# Altium schematic sheet Voltage_generation.SchDoc
size A3; SheetNumber: 3; SheetTotal: 3
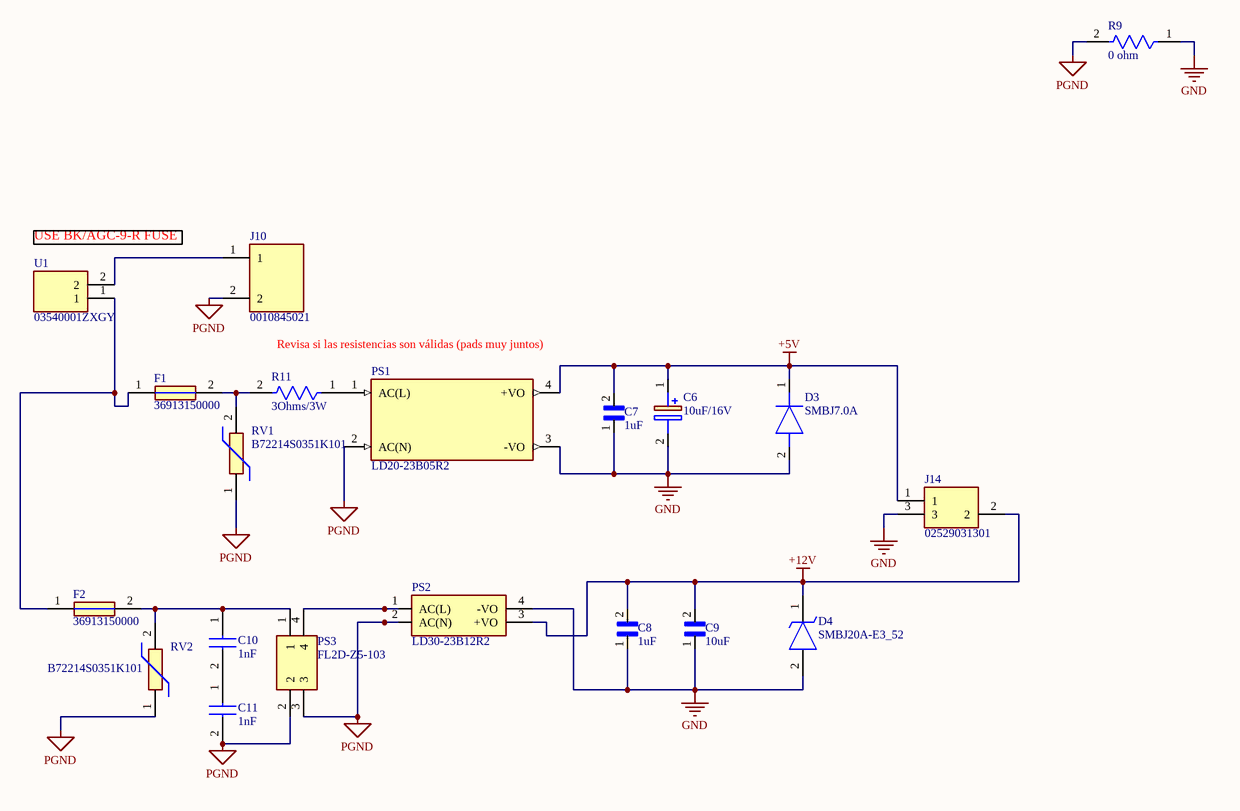
[diagram p0: Voltage_generation.SchDoc]

## Parts
C6  10uF/16V  [CAPPRD200W52D500H1250]
C7  1uF  [1206C]
C8  1uF  [1206C]
C9  10uF  [1206C]
C10  1nF  [C907U102MYVDBA7317]
C11  1nF  [C907U102MYVDBA7317]
D3  SMBJ7.0A  [DIOM5336X244N]
D4  SMBJ20A-E3_52  [DIOM5436X244N]
F1  36913150000  [36913150000]
F2  36913150000  [36913150000]
J10  0010845021  [0010845021_MOLEX]
J14  02529031301  [02529031301]
PS1  LD20-23B05R2  [CONV_LD20-23B05R2]
PS2  LD30-23B12R2  [LD3023B12R2]
PS3  FL2D-Z5-103  [FL2DZ5103]
R9  0 ohm  [0603R]
R11  3Ohms/3W  [Rohm_LTR100_IPC_A]
RV1  B72214S0351K101  [B72214S0351K101]
RV2  B72214S0351K101  [B72214S0351K101]
U1  03540001ZXGY  [Fuse_1]

## Nets
+5V: C6.1(+) C7.2 D3.1(K) J14.1 PS1.4(+VO)
+12V: C8.2 C9.2 D4.1(K) J14.2 PS2.3(+VO)
GND: C6.2(-) C7.1 C8.1 C9.1 D3.2(A) D4.2(A) J14.3 PS1.3(-VO) PS2.4(-VO) R9.1
PGND: C11.2 J10.2 PS1.2(AC(N)) PS2.2(AC(N)) PS3.2 PS3.3 R9.2 RV1.1 RV2.1
NetC10_1: C10.1 F2.2 PS3.1 RV2.2
NetC10_2: C10.2 C11.1
NetF1_1: F1.1 F2.1 U1.1
NetF1_2: F1.2 R11.2 RV1.2
NetJ10_1: J10.1 U1.2
NetPS1_1: PS1.1(AC(L)) R11.1
NetPS2_1: PS2.1(AC(L)) PS3.4

## Notes on the sheet
- (near U1) USE BK/AGC-9-R FUSE
- Revisa si las resistencias son válidas (pads muy juntos)
- Designed By:
- Electric DC engine and Battery controller
- AlvaroNJ

## Library data of the parts
C6 = 860010372001: Capacitor Polarised; Manufacturer_Name: Wurth Elektronik; Datasheet Link: https://ms.componentsearchengine.com/Datasheets/2/860010372001.pdf; Height: 12.5mm; Manufacturer_Part_Number: 860010372001; Mouser Part Number: 710-860010372001; Mouser Price/Stock: https://www.mouser.co.uk/ProductDetail/Wurth-Elektronik/860010372001?qs=0KOYDY2FL29NKHIi2kspeA%3D%3D
C7 = Ceramic_Capacitor: 1 µF ±10% 50V Capacitores cerámicos X7R 1206 (3216 métrico); Manufacturer: Samsung; Manufacturer Part number: CL31B105KBHNNNE; Value: 1uF
C8 = Ceramic_Capacitor: 1 µF ±10% 50V Capacitores cerámicos X7R 1206 (3216 métrico); Manufacturer: Samsung; Manufacturer Part number: CL31B105KCHSNNE; Value: 1uF
C9 = Ceramic_Capacitor: 1 µF ±10% 50V Capacitores cerámicos X7R 1206 (3216 métrico); Manufacturer: Samsung; Manufacturer Part number: CL31A106MBHNNNE; Value: 10uF
C10 C11 = C907U102MYVDBA7317: Capacitor; Manufacturer_Name: KEMET; Datasheet Link: https://content.kemet.com/datasheets/KEM_C1064_X1_400_VAC_Y2_250_VAC.pdf; Height: 7mm; Manufacturer_Part_Number: C907U102MYVDBA7317; Mouser Part Number: 80-C907U102MYVDBAP; Mouser Price/Stock: https://www.mouser.co.uk/ProductDetail/KEMET/C907U102MYVDBA7317?qs=gqcQgTT0fkjWEB%2FDOlQ0cA%3D%3D; Arrow Part Number: C907U102MYVDBA7317; Arrow Price/Stock: https://www.arrow.com/en/products/c907u102myvdba7317/kemet-corporation; Value: 1nF
D3 = SMBJ7.0A: Diode; Manufacturer_Name: HY Electronic; Height: 2.44mm; Manufacturer_Part_Number: SMBJ7.0A
D4 = SMBJ20A-E3_52: TVS Diode (Uni-directional); Manufacturer_Name: Vishay; Manufacturer_Part_Number: SMBJ20A-E3/52; Datasheet Link: http://www.vishay.com/docs/88392/smbj.pdf; Height: 2.44mm; Mouser Part Number: 625-SMBJ20A-E3; Mouser Price/Stock: https://www.mouser.co.uk/ProductDetail/Vishay-General-Semiconductor/SMBJ20A-E3-52?qs=%252BKsK5HlK7GGHijeGSDEfxQ%3D%3D; Arrow Part Number: SMBJ20A-E3/52; Arrow Price/Stock: https://www.arrow.com/en/products/smbj20a-e352/vishay?region=nac
F1 F2 = 36913150000: Fuse; Manufacturer_Name: LITTELFUSE; Datasheet Link: https://componentsearchengine.com/Datasheets/1/36913150000.pdf; Height: 8mm; Manufacturer_Part_Number: 36913150000; Mouser Part Number: 576-36913150000; Mouser Price/Stock: https://www.mouser.co.uk/ProductDetail/Littelfuse/36913150000?qs=A0AD9A9uYPZCz%252Bhb2n2Ctg%3D%3D; Arrow Part Number: 36913150000; Arrow Price/Stock: https://www.arrow.com/en/products/36913150000/littelfuse?region=nac
J10 = 0010845021: Connector; Manufacturer: MOLEX; Manufacturer Part number: 0010845021
J14 = 02529031301: Connector; Manufacturer_Name: HARTING; Datasheet Link: https://b2b.harting.com/files/download/PRD/PDF_DS/PDF_DS_02529031301_EN.pdf; Height: 11.6mm; Manufacturer_Part_Number: 02529031301; Mouser Part Number: 617-02529031301; Mouser Price/Stock: https://www.mouser.co.uk/ProductDetail/HARTING/02529031301?qs=pUKx8fyJudBResgWdfe%2F7g%3D%3D
PS1 = LD20-23B05R2: Enclosed AC DC Converters 1 Uitgang 5V - - - 4A 85 ~ 305 VAC, 100 ~ 430 VDC Input; Manufacturer: Mornsun America, LLC; Digi-Key_Part_Number: 2725-LD20-23B05R2-ND; SnapEDA_Link: https://www.snapeda.com/parts/LD20-23B05R2/MORNSUN/view-part/?ref=snap; Purchase-URL: https://pricing.snapeda.com/search/part/LD20-23B05R2/?ref=eda; Package: CUSTOM-4 MORNSUN; Check_prices: https://www.snapeda.com/parts/LD20-23B05R2/MORNSUN/view-part/?ref=eda; Value: *; Manufacturer Part number: LD20-23B05R2
PS2 = LD30-23B12R2: Power Supply; Manufacturer_Name: Mornsun Power; Datasheet Link: https://www.mornsun-power.com/html/pdf/LD30-23B12R2.html; Height: 24.5mm; Manufacturer_Part_Number: LD30-23B12R2
PS3 = FL2D-Z5-103: Power Supply; Manufacturer_Name: Mornsun Power; Datasheet Link: https://datasheet.lcsc.com/szlcsc/1811091611_MORNSUN-Guangzhou-S-T-FL2D-Z5-103_C191603.pdf; Height: 18mm; Manufacturer_Part_Number: FL2D-Z5-103
R9 = Resistor: Manufacturer: Yageo; Manufacturer Part number: RC0603FR-070RL; Value: 0 ohm
R11 = Resistor: 3 Ohms ±5% 3W Resistencia en microprocesador Ancho 2512 (6432 métrico), 1225 AEC-Q200 automotriz, protección contra impulsos Película gruesa; Manufacturer: Rohm; Manufacturer Part number: LTR100JZPJ3R0; Value: 3Ohms/3W
RV1 RV2 = B72214S0351K101: Varistor; Manufacturer_Name: TDK; Datasheet Link: https://product.tdk.com/system/files/dam/doc/product/protection/voltage/lead-disk-varistor/data_sheet/70/db/var/siov_leaded_standard.pdf; Height: 18.5mm; Manufacturer_Part_Number: B72214S0351K101; Arrow Part Number: B72214S0351K101; Arrow Price/Stock: https://www.arrow.com/en/products/b72214s0351k101/epcos-tdk?region=nac
U1 = 03540001ZXGY: Undefined or Miscellaneous; Manufacturer_Name: LITTELFUSE; Datasheet Link: https://m.littelfuse.com/~/media/electronics/datasheets/fuse_blocks/littelfuse_fuse_block_354_datasheet.pdf.pdf; Height: 13mm; Manufacturer_Part_Number: 03540001ZXGY; Mouser Part Number: 576-03540001ZXGY; Mouser Price/Stock: https://www.mouser.co.uk/ProductDetail/Littelfuse/03540001ZXGY?qs=2VFNtWizgieffhgauIF6XA%3D%3D; Arrow Part Number: 03540001ZXGY; Arrow Price/Stock: https://www.arrow.com/en/products/03540001zxgy/littelfuse?region=nac